# Altium schematic sheet BB_AMP.SchDoc
size 431 x 279 mm
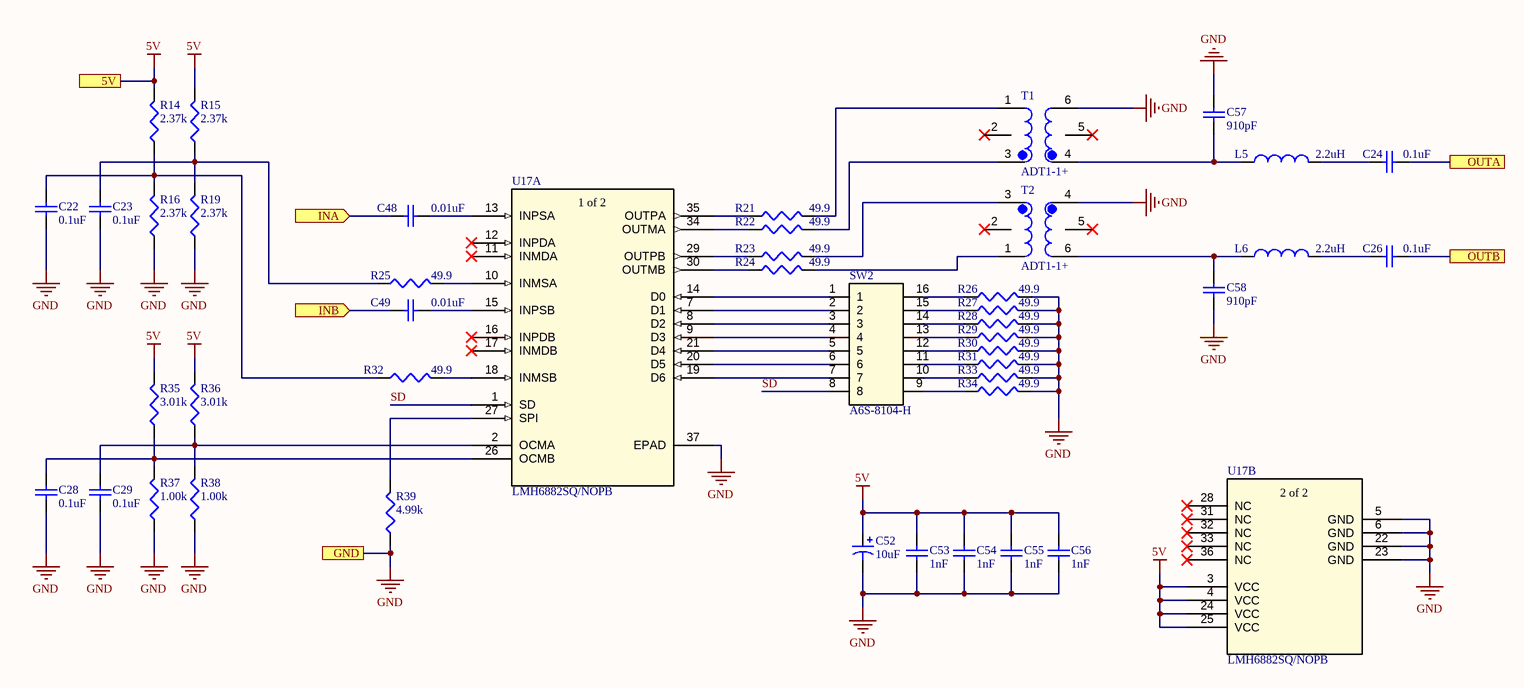
[diagram p0: BB_AMP.SchDoc]

## Parts
C22  0.1uF  [SMD-0603]
C23  0.1uF  [SMD-0603]
C24  0.1uF  [SMD-0603]
C26  0.1uF  [SMD-0603]
C28  0.1uF  [SMD-0603]
C29  0.1uF  [SMD-0603]
C48  0.01uF  [SMD-0402]
C49  0.01uF  [SMD-0402]
C52  10uF  [CAP_TANT_1206_POL]
C53  1nF  [SMD-0402]
C54  1nF  [SMD-0402]
C55  1nF  [SMD-0402]
C56  1nF  [SMD-0402]
C57  910pF  [SMD-0603]
C58  910pF  [SMD-0603]
L5  2.2uH  [SMD-0603]
L6  2.2uH  [SMD-0603]
R14  2.37k  [SMD-0603]
R15  2.37k  [SMD-0603]
R16  2.37k  [SMD-0603]
R19  2.37k  [SMD-0603]
R21  49.9  [SMD-0402]
R22  49.9  [SMD-0402]
R23  49.9  [SMD-0402]
R24  49.9  [SMD-0402]
R25  49.9  [SMD-0402]
R26  49.9  [SMD-0603]
R27  49.9  [SMD-0603]
R28  49.9  [SMD-0603]
R29  49.9  [SMD-0603]
R30  49.9  [SMD-0603]
R31  49.9  [SMD-0603]
R32  49.9  [SMD-0402]
R33  49.9  [SMD-0603]
R34  49.9  [SMD-0603]
R35  3.01k  [SMD-0603]
R36  3.01k  [SMD-0603]
R37  1.00k  [SMD-0603]
R38  1.00k  [SMD-0603]
R39  4.99k  [SMD-0603]
SW2  A6S-8104-H  [A6S-8101-H]
T1  ADT1-1+  [XFMR_ADT1-1+]
T2  ADT1-1+  [XFMR_ADT1-1+]
U17  LMH6882SQ/NOPB  [NJK36_TEX]  (parts A,B of 2)

## Ports
5V, GND, INA (in), INB (in), OUTA, OUTB

## Nets
5V: C52.1 C53.2 C54.2 C55.2 C56.2 R14.2 R15.2 R35.2 R36.2 U17.3(VCC) U17.4(VCC) U17.24(VCC) U17.25(VCC) ; port 5V
GND: C22.1 C23.1 C28.1 C29.1 C52.2 C53.1 C54.1 C55.1 C56.1 C57.2 C58.1 R16.1 R19.1 R26.2 R27.2 R28.2 R29.2 R30.2 R31.2 R33.2 R34.2 R37.1 R38.1 R39.1 T1.6 T2.4 U17.5(GND) U17.6(GND) U17.22(GND) U17.23(GND) U17.37(EPAD) ; port GND
INA: C48.1 ; port INA
INB: C49.1 ; port INB
OUTA: C24.2 ; port OUTA
OUTB: C26.2 ; port OUTB
SD: SW2.8 U17.1(SD)
NetC22_2: C22.2 R14.1 R16.2 R32.1
NetC23_2: C23.2 R15.1 R19.2 R25.1
NetC24_1: C24.1 L5.2
NetC26_1: C26.1 L6.2
NetC28_2: C28.2 R35.1 R37.2 U17.26(OCMB)
NetC29_2: C29.2 R36.1 R38.2 U17.2(OCMA)
NetC48_2: C48.2 U17.13(INPSA)
NetC49_2: C49.2 U17.15(INPSB)
NetC57_1: C57.1 L5.1 T1.4
NetC58_2: C58.2 L6.1 T2.6
NetR21_1: R21.1 U17.35(OUTPA)
NetR21_2: R21.2 T1.1
NetR22_1: R22.1 U17.34(OUTMA)
NetR22_2: R22.2 T1.3
NetR23_1: R23.1 U17.29(OUTPB)
NetR23_2: R23.2 T2.3
NetR24_1: R24.1 U17.30(OUTMB)
NetR24_2: R24.2 T2.1
NetR25_2: R25.2 U17.10(INMSA)
NetR26_1: R26.1 SW2.16
NetR27_1: R27.1 SW2.15
NetR28_1: R28.1 SW2.14
NetR29_1: R29.1 SW2.13
NetR30_1: R30.1 SW2.12
NetR31_1: R31.1 SW2.11
NetR32_2: R32.2 U17.18(INMSB)
NetR33_1: R33.1 SW2.10
NetR34_1: R34.1 SW2.9
NetR39_2: R39.2 U17.27(SPI)
NetSW2_1: SW2.1 U17.14(D0)
NetSW2_2: SW2.2 U17.7(D1)
NetSW2_3: SW2.3 U17.8(D2)
NetSW2_4: SW2.4 U17.9(D3)
NetSW2_5: SW2.5 U17.21(D4)
NetSW2_6: SW2.6 U17.20(D5)
NetSW2_7: SW2.7 U17.19(D6)

Not connected (* = marked no-connect by the designer): T1 2(NC)* 5*; T2 2(NC)* 5*; U17 11(INMDA)* 12(INPDA)* 16(INPDB)* 17(INMDB)* 28(NC)* 31(NC)* 32(NC)* 33(NC)* 36(NC)*

## Notes on the sheet
- DWG. NO.
- REV.
- SHT.
- THIS DOCUMENT AND THE DATA DISCLOSED HEREIN OR HEREWITH IS THE PROPERTY OF ALTIUM LIMITED AND MAY BE FREELY DISTRIBUTED IN WHOLE. NO RIGHTS ARE RESERVED OR EXPRESS OR IMPLIED WARANTEE GIVEN.
- REVISION
- DESCRIPTION
- DATE
- APPROVED
- ENG:
- APPROVALS
- PROJECT
- DSN:
- CHK:
- REFERENCE DOCUMENTS
- PROJECT REVISION:
- TITLE
- DOCUMENT REVISION:
- DESIGN ITEM:
- BOM:
- FAB DWG:
- PCB DWG:
- ASSY DWG:
- SCALE:
- SIZE
- B
- CAGE CODE
- FILE NAME
- DWG NO.
- SHEET
- OF
- REV
- (in symbol LMH6882, part A) 1 of 2
- (in symbol LMH6882, part B) 2 of 2

## Library data of the parts
C22-C24 C26 C28 C29 C57 C58 = CAP0603: Ceramic Capacitor 0603
C48 C49 C53-C56 = CAP0402: Ceramic Capacitor 0402
C52 = CAP_TANT_1206: Polarized Cap, Size 1206 Imperial (3216 Metric), Tantalum
L5 L6 = L0603: Inductor 0603
R14-R16 R19 R26-R31 R33-R39 = RES0603: Resistor-0603
R21-R25 R32 = RES0402: Resistor-0402
SW2 = A6S-8104-H: Dip Switch SPST 8 Position Surface Mount Slide (Standard) Actuator 25mA 24VDC; Vendor: Omron; Built_By: EMA_Kyle; SourceLibrary: Omron_2019-09-26; Manufacturer_Part_Number: A6S-8104-H; Copyright: Copyright (C) 2018 Accelerated Designs. All rights reserved; RefDes: RefDes; Type: DEV
T1 T2 = ADT1-1+: RF Transformer, 50 ohm, 1:1, 0.15-400 MHz, SMT; MP: ADT1-6T+; MF: Mini-Circuits; SnapEDA_Link: https://www.snapeda.com/parts/ADT1-6T+/Mini-Circuits/view-part/948642/?ref=snap; Availability: Unavailable; Price: None; Value: *; Package: None
U17 = LMH6882: LMH6882 DC to 2.4-GHz, High-Linearity, Dual, Programmable Differential Amplifier; SourceLibrary: TI_2017-02-16; Built_By: EMA_UL_Team; Vendor: Texas Instruments; Manufacturer_Part_Number: LMH6882SQ/NOPB; Copyright: Copyright (C) 2018 Accelerated Designs. All rights reserved; RefDes: RefDes; Type: DEV